# EAGLE schematic Logic Engine v0.1 (EAGLE 6.5.0)
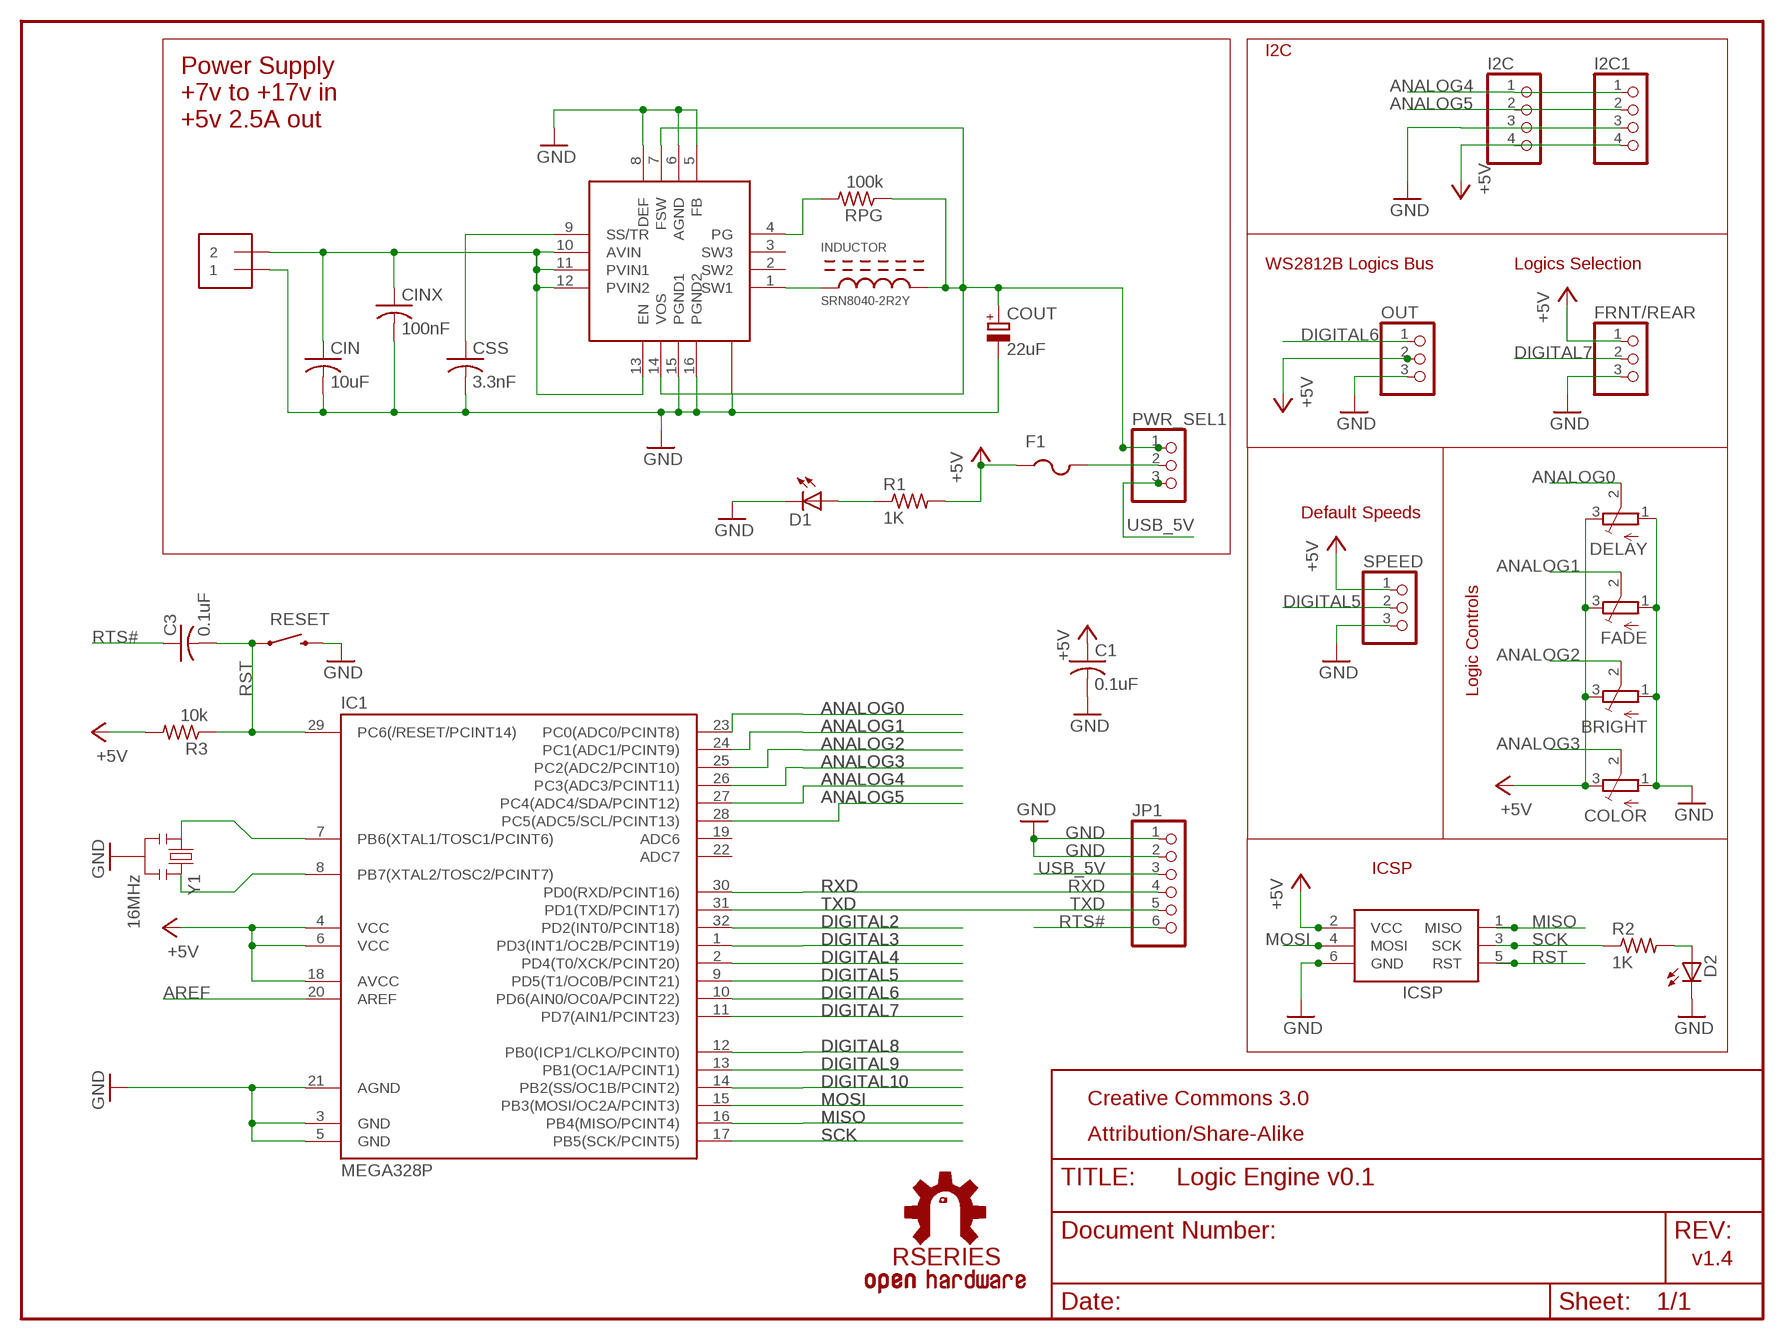
[diagram p0: schematic, sheet 1]

## Parts
BRIGHT  TRIMPOT3364W  [3364]
C1  0.1uF  C-USC0805K  [C0805K]
C3  0.1uF  C-USC0805K  [C0805K]
CIN  10uF  C-USC1206  [C1206]
CINX  100nF  C-USC0805K  [C0805K]
COLOR  TRIMPOT3364W  [3364]
COUT  22uF  CAPACITOR_POL-CASE_B  [CASE_B]
CSS  3.3nF  C-USC0805K  [C0805K]
D1  LEDCHIPLED_1206  [CHIPLED_1206]
D2  Green  LEDCHIPLED_1206  [CHIPLED_1206]
DELAY  TRIMPOT3364W  [3364]
EXT.PWR  1X2-3.5MM  [1X2-3.5MM]
F1  PTCFUSE-1812  [1812]
FADE  TRIMPOT3364W  [3364]
FRNT/REAR  PINHD-1X3  [1X03]
I2C  PINHD-1X4CB  [1X04-CB]
I2C1  PINHD-1X4CB  [1X04-CB]
IC1  MEGA328P  MEGA48/88/168-AU  [TQFP32-08]
ICSP  AVRISP-6  [AVRISP]
INDUCTOR  SRN8040-2R2Y  SRN8040  [SRN8040]
JP1  PINHD-1X6CLEAN  [1X06-CLEAN]
OUT  PINHD-1X3  [1X03]
PWR_SEL1  PINHD-1X3  [1X03]
R1  1K  R-US_R0805  [R0805]
R2  1K  R-US_R0805  [R0805]
R3  10k  R-US_R0805  [R0805]
REG  TPS62133  TPS6213X  [TPS6213X]
RESET  SWITCH-MOMENTARY-2SMD  [TACTILE_SWITCH_SMD]
RPG  100k  R-US_R0805  [R0805]
SPEED  PINHD-1X3  [1X03]
U$2  RSERIES-OSHW-LOGOMEDIUM  [RSERIES-OSHW-LOGO-MEDIUM]
Y1  16MHz  RESONATOR16MHZ  [RESONATOR-SMD]

## Nets
+5V [supply]: BRIGHT.3(E) C1.1 COLOR.3(E) DELAY.3(E) F1.1 FADE.3(E) FRNT/REAR.1 I2C1.4 I2C.4 IC1.4(VCC) IC1.6(VCC) IC1.18(AVCC) ICSP.2(VCC) OUT.2 R1.2 R3.2 SPEED.1
ANALOG0: DELAY.2(S) IC1.23(PC0(ADC0/PCINT8))
ANALOG1: FADE.2(S) IC1.24(PC1(ADC1/PCINT9))
ANALOG2: BRIGHT.2(S) IC1.25(PC2(ADC2/PCINT10))
ANALOG3: COLOR.2(S) IC1.26(PC3(ADC3/PCINT11))
ANALOG4: I2C1.1 I2C.1 IC1.27(PC4(ADC4/SDA/PCINT12))
ANALOG5: I2C1.2 I2C.2 IC1.28(PC5(ADC5/SCL/PCINT13))
AREF: IC1.20(AREF)
DIGITAL2: IC1.32(PD2(INT0/PCINT18))
DIGITAL3: IC1.1(PD3(INT1/OC2B/PCINT19))
DIGITAL4: IC1.2(PD4(T0/XCK/PCINT20))
DIGITAL5: IC1.9(PD5(T1/OC0B/PCINT21)) SPEED.2
DIGITAL6: IC1.10(PD6(AIN0/OC0A/PCINT22)) OUT.1
DIGITAL7: FRNT/REAR.2 IC1.11(PD7(AIN1/PCINT23))
DIGITAL8: IC1.12(PB0(ICP1/CLKO/PCINT0))
DIGITAL9: IC1.13(PB1(OC1A/PCINT1))
DIGITAL10: IC1.14(PB2(SS/OC1B/PCINT2))
GND [supply]: BRIGHT.1(A) C1.2 CIN.2 CINX.2 COLOR.1(A) COUT.- CSS.2 D1.C D2.C DELAY.1(A) EXT.PWR.1 FADE.1(A) FRNT/REAR.3 I2C1.3 I2C.3 IC1.3(GND) IC1.5(GND) IC1.21(AGND) ICSP.6(GND) JP1.1 JP1.2 OUT.3 REG.5(FB) REG.6(AGND) REG.8(DEF) REG.15(PGND1) REG.16(PGND2) REG.17-THERMALPAD(THERM) RESET.3 SPEED.3 Y1.2
MISO: IC1.16(PB4(MISO/PCINT4)) ICSP.1(MISO)
MOSI: IC1.15(PB3(MOSI/OC2A/PCINT3)) ICSP.4(MOSI)
N$1: IC1.7(PB6(XTAL1/TOSC1/PCINT6)) Y1.1
N$2: IC1.8(PB7(XTAL2/TOSC2/PCINT7)) Y1.3
N$3: INDUCTOR.P$1(P1) REG.1(SW1)
N$4: D2.A R2.2
N$5 [supply]: D1.A R1.1
N$6 [supply]: CIN.1 CINX.1 EXT.PWR.2 REG.10(AVIN) REG.11(PVIN1) REG.12(PVIN2) REG.13(EN)
N$7: CSS.1 REG.9(SS/TR)
N$8: REG.4(PG) RPG.2
N$9 [supply]: COUT.+ INDUCTOR.P$2(P2) PWR_SEL1.1 REG.7(FSW) REG.14(VOS) RPG.1
N$10: F1.2 PWR_SEL1.2
RST: C3.2 IC1.29(PC6(/RESET/PCINT14)) ICSP.5(RST) R3.1 RESET.1
RTS#: C3.1 JP1.6
RXD: IC1.30(PD0(RXD/PCINT16)) JP1.4
SCK: IC1.17(PB5(SCK/PCINT5)) ICSP.3(SCK) R2.1
TXD: IC1.31(PD1(TXD/PCINT17)) JP1.5
USB_5V [supply]: JP1.3 PWR_SEL1.3
Unconnected: IC1.19(ADC6) IC1.22(ADC7) REG.2(SW2) REG.3(SW3)

## Notes on the sheet
- I2C
- Power Supply
  +7v to +17v in
  +5v 2.5A out
- WS2812B Logics Bus | Logics Selection
- Default Speeds
- Logic Controls
- ICSP
- Creative Commons 3.0
- Attribution/Share-Alike
- v1.4

## Library data of the parts
BRIGHT COLOR DELAY FADE = rseries:TRIMPOT: SMT trimmer potentiometer part number TC33X http://www.ladyada.net/library/eagle
C1 C3 CIN CINX CSS = adafruit:C-US: CAPACITOR, American symbol
COUT = dp_devices:CAPACITOR_POL: Polarized capacitor in various packages
D1 D2 = minimidi:LED: LED OSRAM: - CHIPLED LG R971, LG N971, LY N971, LG Q971, LY Q971, LO R971, LY R971 LH N974, LH R974 LS Q976, LO Q976, LY Q976 LO Q996 - Hyper CHIPLED LW Q18S LB Q993, LB Q99A, LB R99A - SideLED LS A670, LO A670, LY A670, LG A670, LP A670 LB A673, LV A673, LT A673, LW A673 LH A674 LY A675 LS A676, LA A676, LO A676, LY A676, LW A676 LS A679, LY A679, LG A679 - Hyper Micro SIDELED® LS Y876, LA Y876, LO Y876, LY Y876 LT Y87S - SmartLED LW L88C, LW L88S LB L89C, LB L89S, LG L890 LS L89K, LO L89K, LY L89K LS L896, LA L896, LO L896, LY L896 - TOPLED LS T670, LO T670, LY T670, LG T670, LP T670 LSG T670, LSP T670, LSY T670, LOP T670, LYG T670 LG T671, LOG T671, LSG T671 LB T673, LV T673, LT T673, LW T673 LH T674 LS T676, LA T676, LO T676, LY T676, LB T676, LH T676, LSB T676, LW T676 LB T67C, LV T67C, LT T67C, LS T67K, LO T67K, LY T67K, LW E67C LS E67B, LA E67B, LO E67B, LY E67B, LB E67C, LV E67C, LT E67C LW T67C LS T679, LY T679, LG T679 LS T770, LO T770, LY T770, LG T770, LP T770 LB T773, LV T773, LT T773, LW T773 LH T774 LS E675, LA E675, LY E675, LS T675 LS T776, LA T776, LO T776, LY T776, LB T776 LHGB T686 LT T68C, LB T68C - Hyper Mini TOPLED® LB M676 - Mini TOPLED Santana® LG M470 LS M47K, LO M47K, LY M47K Source: http://www.osram.convergy.de/
EXT.PWR = adafruit:1X2: 3.5mm Terminal block http://www.ladyada.net/library/pcb/eaglelibrary.html
F1 = adafruit:PTCFUSE: PTC fuses, resettable thermistors
FRNT/REAR OUT PWR_SEL1 SPEED = pinhead:PINHD-1X3: PIN HEADER
I2C I2C1 = carduino:PINHD-1X4: PIN HEADER
IC1 = avr-7:MEGA48/88/168
ICSP = adafruit:AVRISP: AVR ISP HEADER Standard 6 pin header for AVR programming
INDUCTOR = joymonkey:SRN8040
JP1 = carduino:PINHD-1X6: PIN HEADER
R1-R3 RPG = adafruit:R-US_: RESISTOR, American symbol
REG = joymonkey:TPS6213X: TPS6213 3-17V 3A Step-Down Converter in 3x3 QFN Package The TPS6213X family is an easy to use synchronous step down DC-DC converter optimized for applications with high power density. A high switching frequency of typically 2.5MHz allows the use of small inductors and provides fast transient response as well as high output voltage accuracy by utilization of the DCS-Control topology. With its wide operating input voltage range of 3V to 17V, the devices are ideally suited for systems powered from either a Li-Ion or other batteries as well as from 12V intermediate power rails. It supports up to 3A continuous output current at output voltages between 0.9V and 6V (with 100% duty cycle mode). The device, available in adjustable and fixed output voltage versions, is packaged in a 16-pin QFN package measuring 3 × 3 mm (RGT).
RESET = SparkFun-Electromechanical:SWITCH-MOMENTARY-2: Various NO switches- pushbuttons, reed, etc
U$2 = rseries:RSERIES-OSHW-LOGO
Y1 = SparkFun-FreqCtrl:RESONATOR: Resonator Small SMD resonator. Used, eg, on the Arduino Pro/ Pro Mini boards. 8MHz- XTAL-08895 16MHz- XTAL-08900; PROD_ID: XTAL-08900

## Net classes
1 supply: width 0.508 mm, drill 0.152 mm, clearance 0.203 mm